# EAGLE design OPT101 (EAGLE 7.5.0)
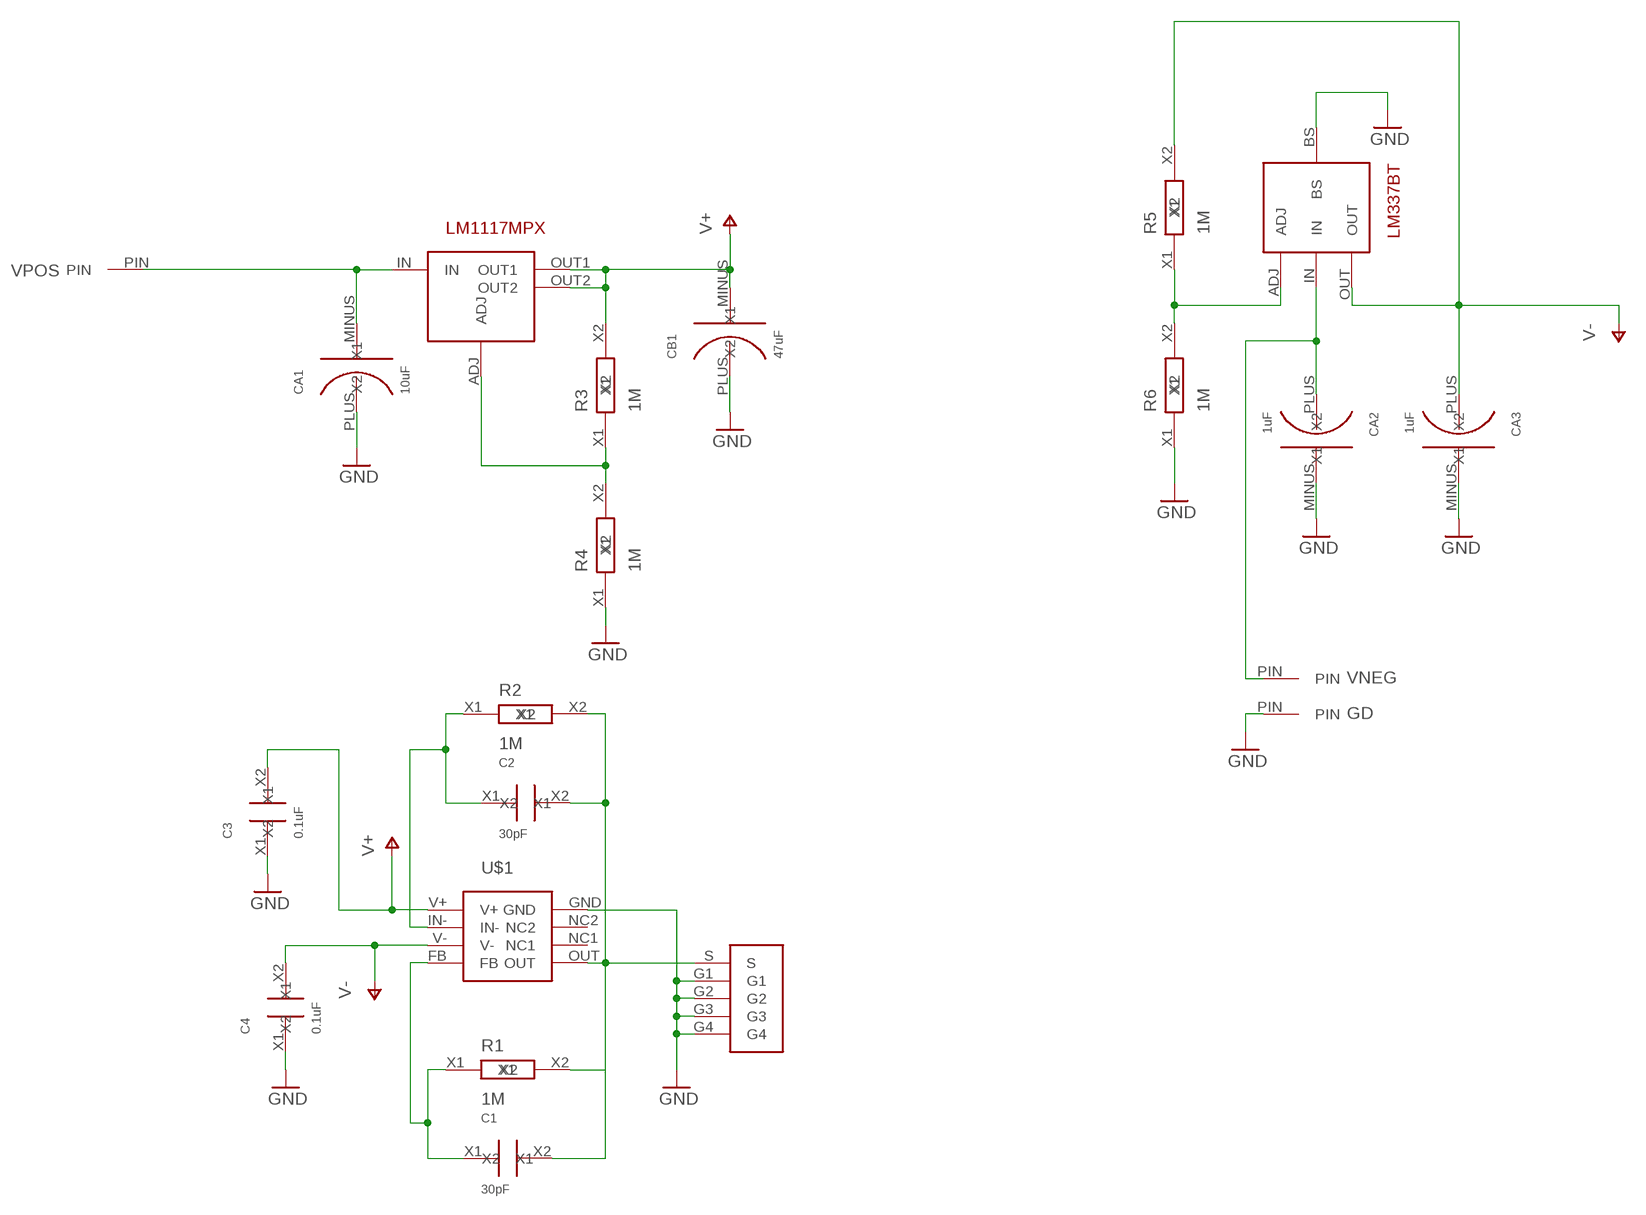
[diagram p0: schematic, sheet 1]

## Parts
C1  30pF  C_SMD_2.1X1.25  [SMD_2.1X1.25]
C2  30pF  C_SMD_2.1X1.25  [SMD_2.1X1.25]
C3  0.1uF  C_SMD_2.1X1.25  [SMD_2.1X1.25]
C4  0.1uF  C_SMD_2.1X1.25  [SMD_2.1X1.25]
CA1  10uF  C_SMD_TA_A  [C_SMD_TA_A]
CA2  1uF  C_SMD_TA_A  [C_SMD_TA_A]
CA3  1uF  C_SMD_TA_A  [C_SMD_TA_A]
CB1  47uF  C_SMD_TA_B  [C_SMD_TA_B]
GD  PIN  [PIN]
R1  1M  R_SMD_2.1X1.25  [SMD_2.1X1.25]
R2  1M  R_SMD_2.1X1.25  [SMD_2.1X1.25]
R3  1M  R_SMD_2.1X1.25  [SMD_2.1X1.25]
R4  1M  R_SMD_2.1X1.25  [SMD_2.1X1.25]
R5  1M  R_SMD_2.1X1.25  [SMD_2.1X1.25]
R6  1M  R_SMD_2.1X1.25  [SMD_2.1X1.25]
U$1  OPT101  [OPT101]
U$2  SMA_AN  [SMA_AN]
U$3  LM1117MPX-ADJ  [LM1117MPX-ADJ]
U$4  LM337BT  [LM337BT]
VNEG  PIN  [PIN]
VPOS  PIN  [PIN]

## Nets
GND: C3.X1 C4.X1 CA1.PLUS(X1) CA2.MINUS(X2) CA3.MINUS(X2) CB1.PLUS(X1) GD.PIN R4.X1 R6.X1 U$1.GND U$2.G1 U$2.G2 U$2.G3 U$2.G4 U$4.BS
N$1: C1.X2 C2.X2 R1.X2 R2.X2 U$1.OUT U$2.S
N$2: C2.X1 R2.X1 U$1.IN-
N$3: C1.X1 R1.X1 U$1.FB
N$4: CA1.MINUS(X2) U$3.IN VPOS.PIN
N$5: R3.X1 R4.X2 U$3.ADJ
N$6: CA2.PLUS(X1) U$4.IN VNEG.PIN
N$8: R5.X1 R6.X2 U$4.ADJ
V+: C3.X2 CB1.MINUS(X2) R3.X2 U$1.V+ U$3.OUT1 U$3.OUT2
V-: C4.X2 CA3.PLUS(X1) R5.X2 U$1.V- U$4.OUT
Unconnected: U$1.NC1 U$1.NC2

## Library data of the parts
C1-C4 = MyPowerComponents:C_SMD_2.1X1.25
CA1-CA3 = MyAmSys:C_SMD_TA_A
CB1 = MyAmSys:C_SMD_TA_B
GD VNEG VPOS = MySTM32F103RGT6:PIN
R1-R6 = MyPowerComponents:R_SMD_2.1X1.25
U$1 = My_OPT:OPT101
U$2 = My_OPT:SMA_AN
U$3 = My_OPT:LM1117MPX-ADJ
U$4 = My_OPT:LM337BT

## Board
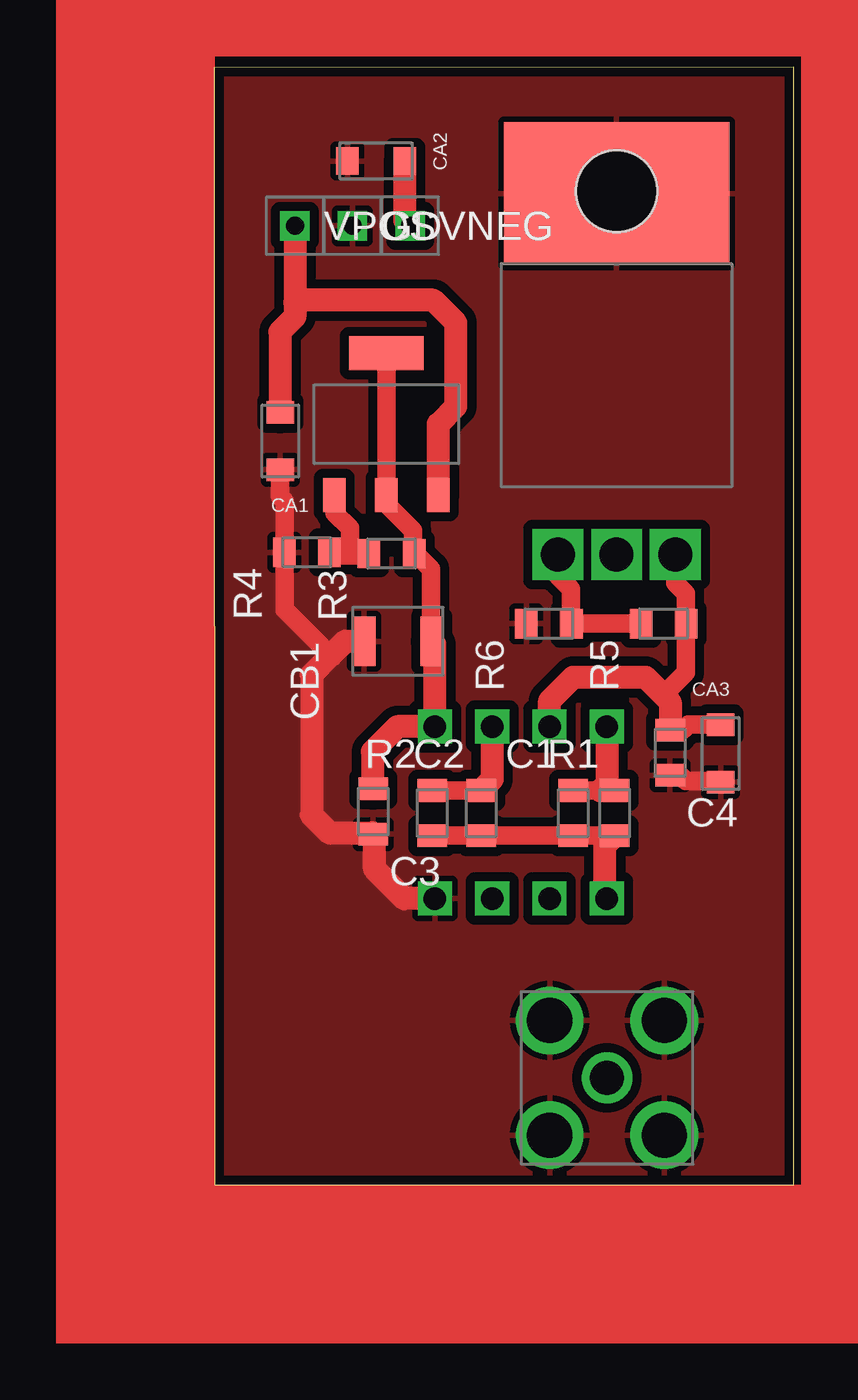
[diagram p1: board, top side]
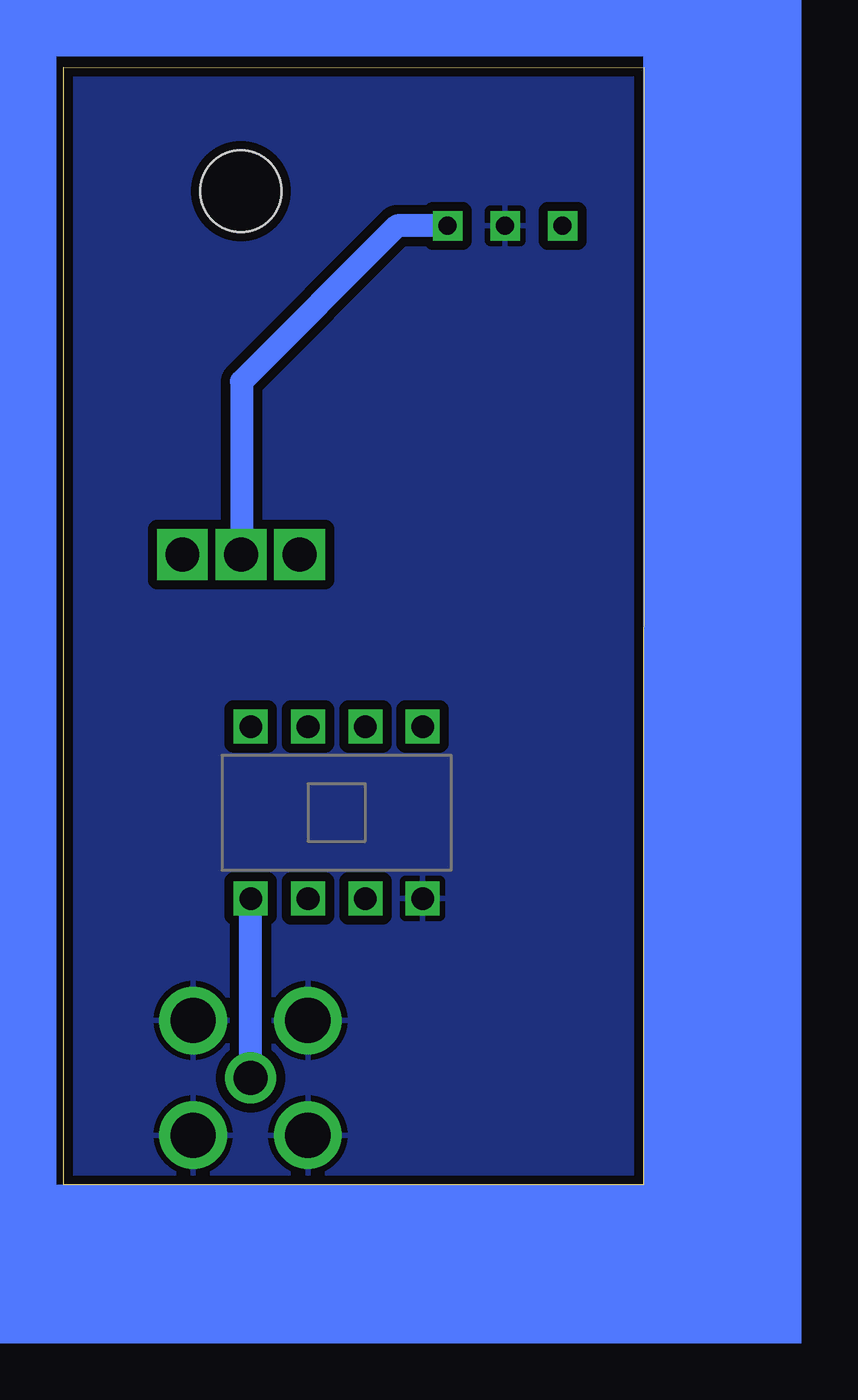
[diagram p2: board, bottom side, seen from below]

Size 25.69 x 49.52 mm. Coordinates in mm from the lower left corner, seen from the top.
Outline: 0.02,0 25.69,0 25.69,49.52 0,49.5 0.02,0
Copper layers (1*16): Top 0.035mm / dielectric 1.5mm / Bottom 0.035mm
Design rules "default *": minimum track width 10mil, minimum drill 24mil, track to track 8mil, track to pad 8mil, pad to pad 8mil, via to via 8mil, smd to smd 8mil, copper to edge 10mil, drill to drill 8mil, minimum pad ring 10mil, minimum via ring 8mil, stop-mask expansion 4mil, vias tented up to drill 0mil, thermal gap 10mil

### Footprints (pad centres in the part's own frame; a part is rotated, then mirrored left to right if it is on the bottom)
SMD_2.1X1.25 = smd 1.3 x 1: X1 0,1; X2 0,-1
C_SMD_TA_A = smd 1.2 x 1: MINUS 0,-1.27; PLUS 0,1.27
C_SMD_TA_B = smd 2.2 x 1: MINUS 0,-2.5; PLUS 0,0.5
PIN = drill 0.8 square: PIN 0,0
OPT101 = drill 1 square: FB -3.81,-3.81; GND 3.81,3.81; IN- -3.81,1.27; NC1 3.81,-1.27; NC2 3.81,1.27; OUT 3.81,-3.81; V+ -3.81,3.81; V- -3.81,-1.27
SMA_AN = drill 2: G1 -2.54,2.54; G2 2.54,2.54; G3 2.54,-2.54; G4 -2.54,-2.54 | drill 1.5: S 0,0
LM1117MPX-ADJ = smd 1 x 1.5: ADJ -2.3,-6.3; IN 2.3,-6.3; OUT1 0,-6.3 | smd 3.3 x 1.5: OUT2 0,0
LM337BT = drill 1.5 square: ADJ -2.6,-16; IN 0,-16; OUT 2.6,-16 | smd 10 x 6.3: BS 0,0 | hole 3.6: 0,0.1

### Placement (x,y rotation side)
C1  15.92,16.48 0 top
C2  11.84,16.48 0 top
C3  7.06,16.55 180 top
C4  20.21,19.15 180 top
CA1  2.94,32.96 180 top
CA2  7.18,45.37 270 top
CA3  22.45,19.12 0 top
CB1  7.15,24.09 90 top
GD  6.14,42.5 0 top
R1  17.76,16.48 0 top
R2  9.68,16.48 0 top
R3  7.87,27.98 90 top
R4  4.12,28.03 90 top
R5  19.92,24.87 90 top
R6  14.84,24.87 90 top
U$1  13.6,16.5 270 bottom
U$2  17.42,4.75 0 top
U$3  7.64,36.86 0 top
U$4  17.84,43.93 0 top
VNEG  8.69,42.5 0 top
VPOS  3.59,42.5 0 top

### Tracks (layer width: path | path; a pad name or v marks a point on that pad's centre or on a via)
GND
  Top 0.813: C4.X1 20.67,18.15 20.92,17.9 22.4,17.9 CA3.MINUS | CA1.PLUS 2.92,31.67 2.92,30.5 3.12,30.3 R4.X1 3.12,25.5 5.17,23.45
  Top 1.016: U$1.GND 8.43,12.69 7.12,14 7.12,15.49 C3.X1 7.01,15.6 5.12,15.6 4.32,16.4 4.32,22.6 5.17,23.45 5.81,24.09 CB1.PLUS
  pour Top (isolate 0.406): 0.02,49.5 25.72,49.5 25.72,0 0.02,0
  pour Bottom (isolate 0.406): 0.02,0 25.72,0 25.72,49.5 0.02,49.5
N$1
  Top 0.813: R1.X2 C1.X2 C2.X2 R2.X2
  Top 1.016: R1.X2 17.32,15.04 17.32,12.69 U$1.OUT
  Bottom 1.016: U$2.S U$1.OUT
N$2
  Top 0.813: R2.X1 C2.X1
  Top 1.016: U$1.IN- 12.33,17.97 C2.X1
N$3
  Top 0.813: C1.X1 17.12,17.48 R1.X1
  Top 1.016: U$1.FB 17.41,17.77 17.12,17.48
N$4
  Top 1.016: VPOS.PIN 3.59,39.1 | 3.59,39.1 3.59,38.47 2.92,37.8 2.92,34.25 CA1.MINUS | U$3.IN 9.94,33.72 10.72,34.5 10.72,38.2 9.72,39.2 3.69,39.2 3.59,39.1
N$5
  Top 0.813: U$3.ADJ 5.34,29.78 6.02,29.1 6.02,27.98
  Top 1.016: R3.X1 6.02,27.98 5.17,27.98 R4.X2
N$6
  Top 1.016: CA2.PLUS 8.45,42.74 VNEG.PIN
  Bottom 1.016: VNEG.PIN 10.92,42.5 17.82,35.6 17.82,27.95 U$4.IN
N$8
  Top 0.813: R5.X1 R6.X2 15.82,24.89 15.82,26.4 15.24,26.98 U$4.ADJ
V+
  Top 0.813: CB1.MINUS 9.62,24.12 9.62,27.3 8.94,27.98 R3.X2 8.82,28.03 8.82,29 7.64,30.18 U$3.OUT1 U$3.OUT2
  Top 1.016: C3.X2 7.02,17.59 7.02,19.2 8.13,20.31 U$1.V+ 9.79,23.95 CB1.MINUS
V-
  Top 0.813: C4.X2 20.77,20.15 21.02,20.4 CA3.PLUS | U$4.OUT 20.44,26.68 20.92,26.2 R5.X2 20.92,22.7 19.92,21.7
  Top 1.016: U$1.V- 14.87,21.45 15.92,22.5 19.12,22.5 19.92,21.7 20.22,21.4 C4.X2
(copper drawn outside any net)
  shapes: Bottom area x5, Top area x4